# Altium project Banker.PrjPCB (part 3 of 5)

## Sheet FPGA.SchDoc: FPGA
size 420 x 297 mm; Author: G.K.; CompanyName: WUT; DrawnBy: G.K.; Organization: CERN; Address1: Warsaw Univeristy of Technology; Address2: Nowowiejska 15/19; DocumentNumber: 2; Revision: -; SheetNumber: 2; SheetTotal: 9; EDA_Number: ARTIQ; Projet: Banker; ModifiedBy: -; CreateDate: XX/XX/XXXX; CheckedDate: -; Title2: LVCMOS banks; DivGrp: ISE; Designer: G.K.; ModifiedDate: -; ProjectName: ADC/DAC MEZZANINE
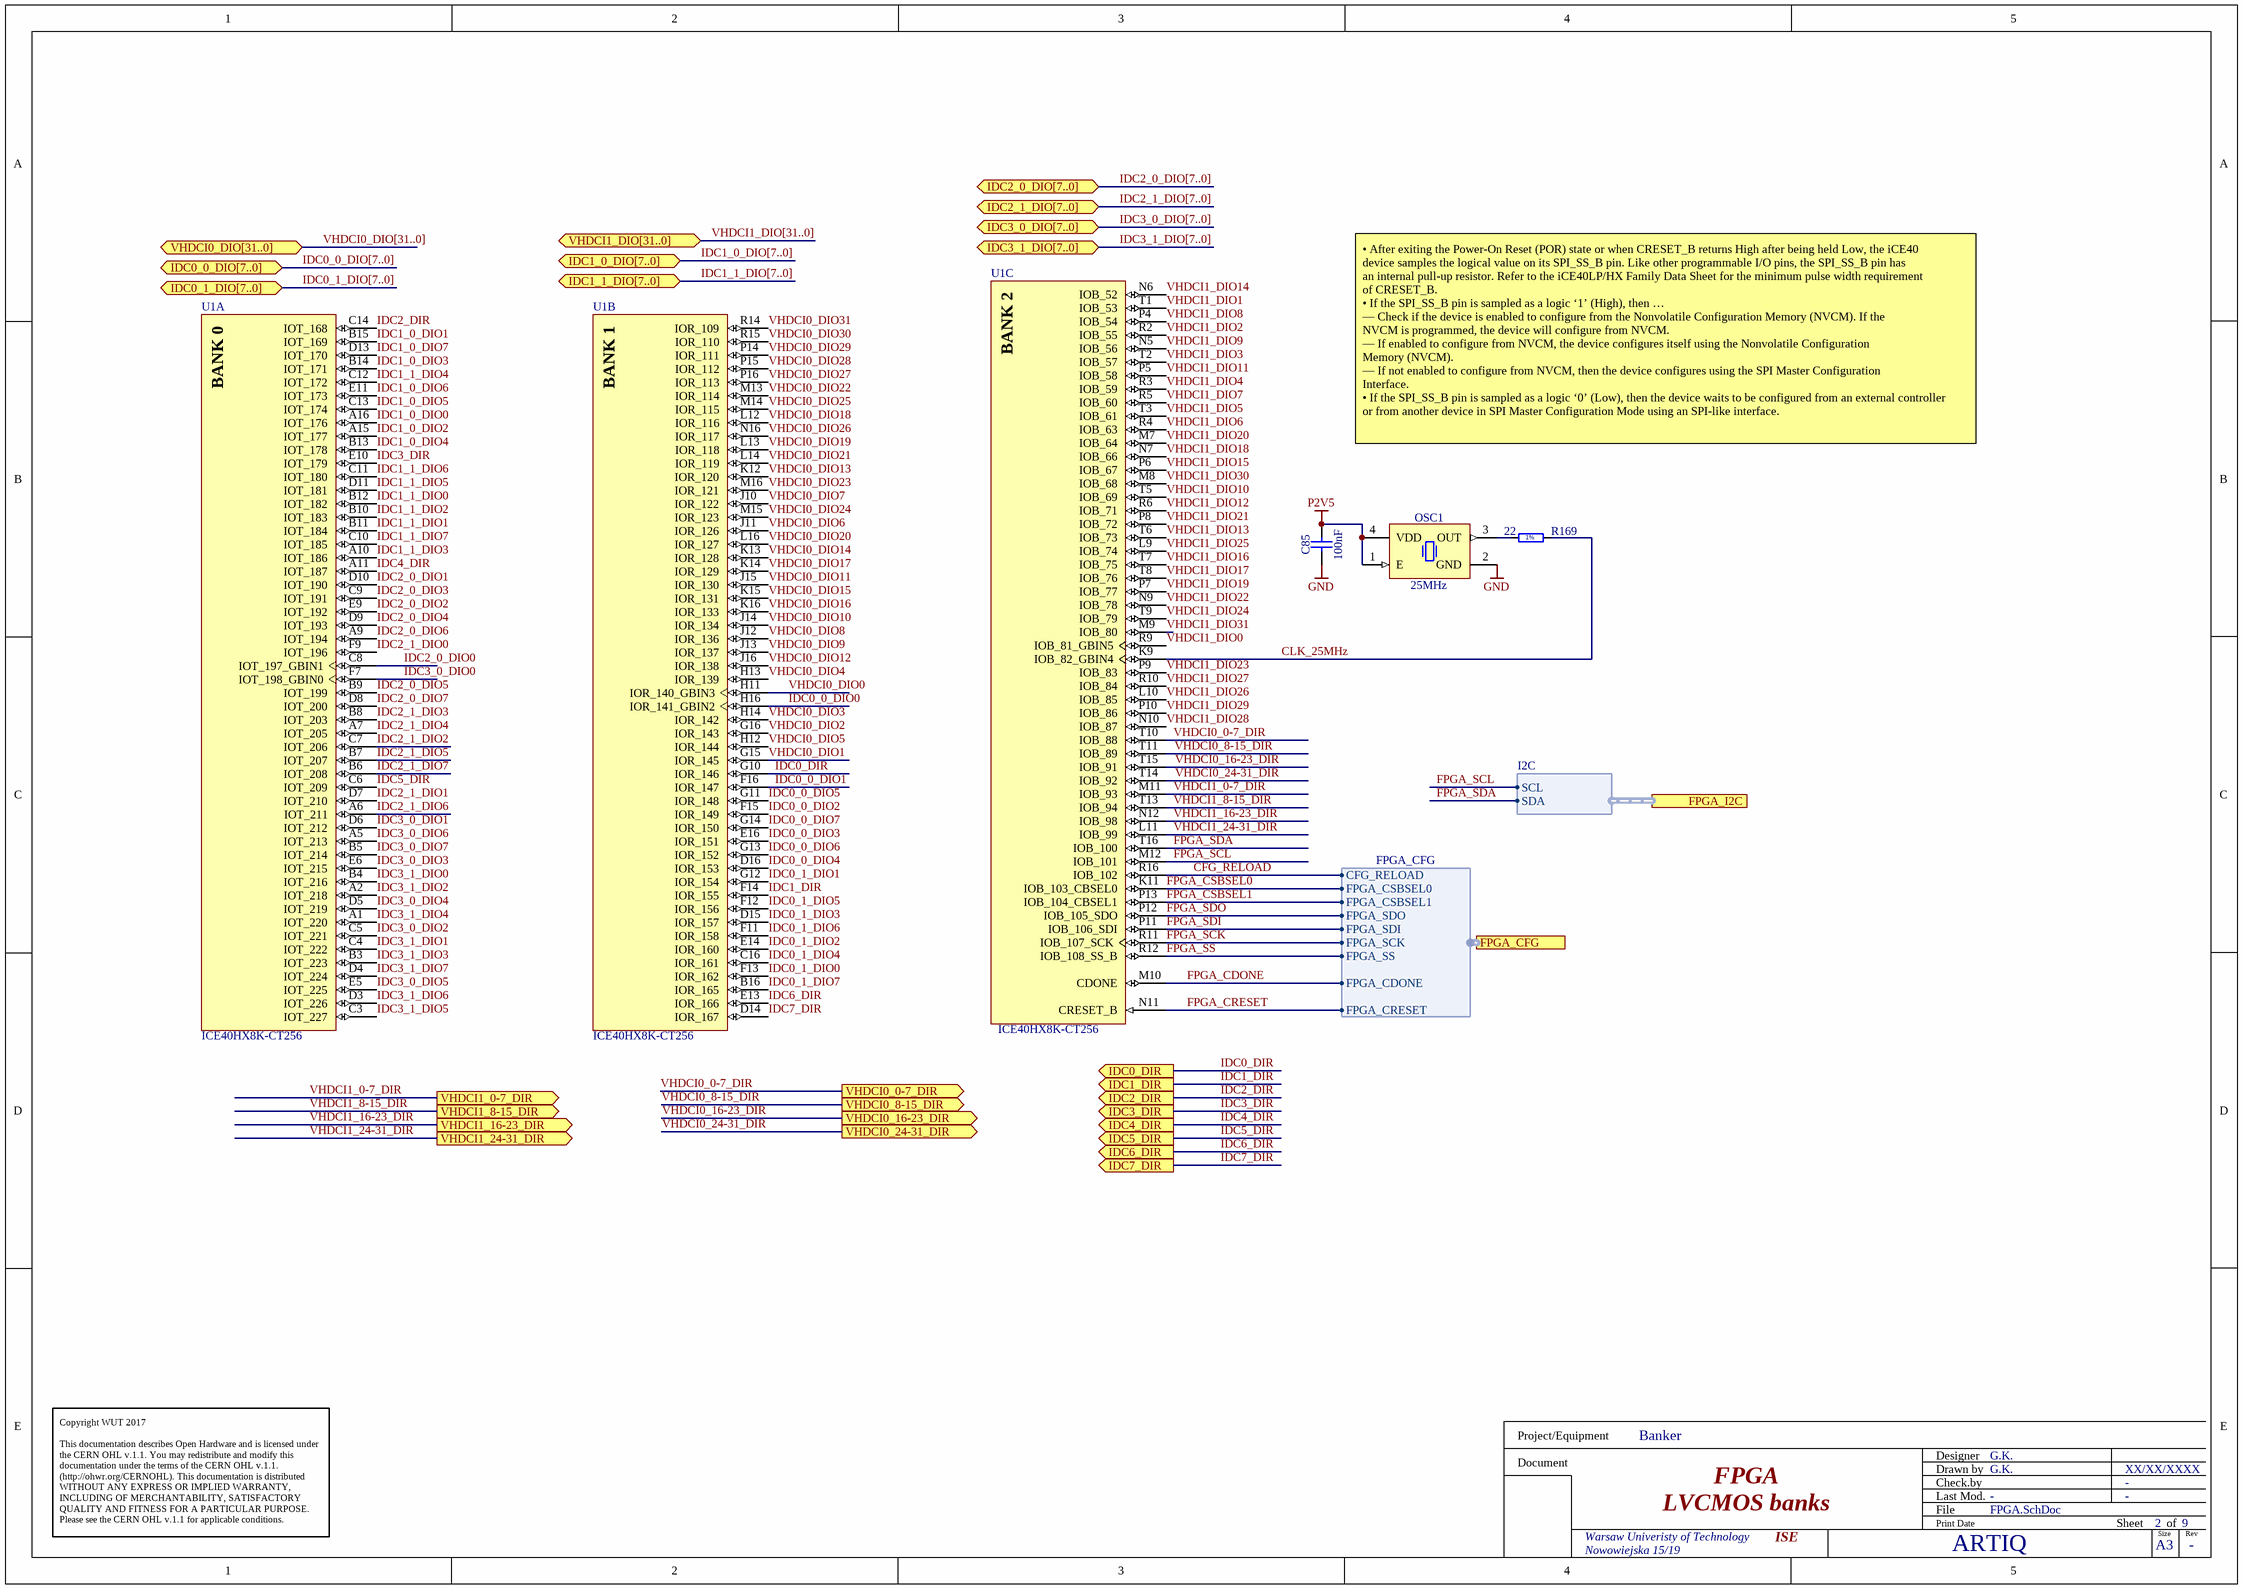
[diagram p5: FPGA.SchDoc]

### Parts
C85  100nF  [CAPC1005X55N]
OSC1  25MHz  [OSC_ECS_ECS-3525]
R169  22  [RESC1005X40N]
U1  ICE40HX8K-CT256  [LATC-caBGA-256]  (parts A,B,C of 5)

### Ports
FPGA_CFG (harness FPGA_CFG), FPGA_I2C (harness I2C), IDC0_0_DIO[7..0] (bidir), IDC0_1_DIO[7..0] (bidir), IDC0_DIR (out), IDC1_0_DIO[7..0] (bidir), IDC1_1_DIO[7..0] (bidir), IDC1_DIR (out), IDC2_0_DIO[7..0] (bidir), IDC2_1_DIO[7..0] (bidir), IDC2_DIR (out), IDC3_0_DIO[7..0] (bidir), IDC3_1_DIO[7..0] (bidir), IDC3_DIR (out), IDC4_DIR (out), IDC5_DIR (out), IDC6_DIR (out), IDC7_DIR (out), VHDCI0_0-7_DIR (out), VHDCI0_8-15_DIR (out), VHDCI0_16-23_DIR (out), VHDCI0_24-31_DIR (out), VHDCI0_DIO[31..0] (bidir), VHDCI1_0-7_DIR (out), VHDCI1_8-15_DIR (out), VHDCI1_16-23_DIR (out), VHDCI1_24-31_DIR (out), VHDCI1_DIO[31..0] (bidir)

### Harnesses
I2C: SDA, SCL
FPGA_CFG: FPGA_CSBSEL0, FPGA_CSBSEL1, FPGA_SDO, FPGA_SDI, FPGA_SCK, FPGA_SS, FPGA_CDONE, FPGA_CRESET, CFG_RELOAD

### Nets
GND: C85.1 OSC1.2(GND)
P2V5: C85.2 OSC1.1(E) OSC1.4(VDD)
CFG_RELOAD: U1.R16(IOB_102) ; port FPGA_CFG.CFG_RELOAD
CLK_25MHz: R169.2 U1.K9(IOB_82_GBIN4)
FPGA_CDONE: U1.M10(CDONE) ; port FPGA_CFG.FPGA_CDONE  [project net CDONE]
FPGA_CRESET: U1.N11(CRESET_B) ; port FPGA_CFG.FPGA_CRESET  [project net CRESET]
FPGA_CSBSEL0: U1.K11(IOB_103_CBSEL0) ; port FPGA_CFG.FPGA_CSBSEL0  [project net CSBSEL0]
FPGA_CSBSEL1: U1.P13(IOB_104_CBSEL1) ; port FPGA_CFG.FPGA_CSBSEL1  [project net CSBSEL1]
FPGA_SCK: U1.R11(IOB_107_SCK) ; port FPGA_CFG.FPGA_SCK  [project net FLASH_SCK]
FPGA_SCL: U1.M12(IOB_101) ; port FPGA_I2C.SCL
FPGA_SDA: U1.T16(IOB_100) ; port FPGA_I2C.SDA
FPGA_SDI: U1.P11(IOB_106_SDI) ; port FPGA_CFG.FPGA_SDI  [project net FLASH_SDO]
FPGA_SDO: U1.P12(IOB_105_SDO) ; port FPGA_CFG.FPGA_SDO  [project net FLASH_SDI]
FPGA_SS: U1.R12(IOB_108_SS_B) ; port FPGA_CFG.FPGA_SS  [project net FLASH_SS]
IDC0_0_DIO0: U1.H16(IOR_141_GBIN2)
IDC0_0_DIO1: U1.F16(IOR_147)
IDC0_0_DIO2: U1.F15(IOR_149)
IDC0_0_DIO3: U1.E16(IOR_151)
IDC0_0_DIO4: U1.D16(IOR_153)
IDC0_0_DIO5: U1.G11(IOR_148)
IDC0_0_DIO6: U1.G13(IOR_152)
IDC0_0_DIO7: U1.G14(IOR_150)
IDC0_1_DIO0: U1.F13(IOR_162)
IDC0_1_DIO1: U1.G12(IOR_154)
IDC0_1_DIO2: U1.E14(IOR_160)
IDC0_1_DIO3: U1.D15(IOR_157)
IDC0_1_DIO4: U1.C16(IOR_161)
IDC0_1_DIO5: U1.F12(IOR_156)
IDC0_1_DIO6: U1.F11(IOR_158)
IDC0_1_DIO7: U1.B16(IOR_165)
IDC0_DIR: U1.G10(IOR_146) ; port IDC0_DIR
IDC1_0_DIO0: U1.A16(IOT_176)  [project net IDC0_DIO0]
IDC1_0_DIO1: U1.B15(IOT_169)  [project net IDC0_DIO1]
IDC1_0_DIO2: U1.A15(IOT_177)  [project net IDC0_DIO2]
IDC1_0_DIO3: U1.B14(IOT_171)  [project net IDC0_DIO3]
IDC1_0_DIO4: U1.B13(IOT_178)  [project net IDC0_DIO4]
IDC1_0_DIO5: U1.C13(IOT_174)  [project net IDC0_DIO5]
IDC1_0_DIO6: U1.E11(IOT_173)  [project net IDC0_DIO6]
IDC1_0_DIO7: U1.D13(IOT_170)  [project net IDC0_DIO7]
IDC1_1_DIO0: U1.B12(IOT_182)
IDC1_1_DIO1: U1.B11(IOT_184)
IDC1_1_DIO2: U1.B10(IOT_183)
IDC1_1_DIO3: U1.A10(IOT_186)
IDC1_1_DIO4: U1.C12(IOT_172)
IDC1_1_DIO5: U1.D11(IOT_181)
IDC1_1_DIO6: U1.C11(IOT_180)
IDC1_1_DIO7: U1.C10(IOT_185)
IDC1_DIR: U1.F14(IOR_155) ; port IDC1_DIR
IDC2_0_DIO0: U1.C8(IOT_197_GBIN1)  [project net IDC0_DIO0]
IDC2_0_DIO1: U1.D10(IOT_190)  [project net IDC0_DIO1]
IDC2_0_DIO2: U1.E9(IOT_192)  [project net IDC0_DIO2]
IDC2_0_DIO3: U1.C9(IOT_191)  [project net IDC0_DIO3]
IDC2_0_DIO4: U1.D9(IOT_193)  [project net IDC0_DIO4]
IDC2_0_DIO5: U1.B9(IOT_199)  [project net IDC0_DIO5]
IDC2_0_DIO6: U1.A9(IOT_194)  [project net IDC0_DIO6]
IDC2_0_DIO7: U1.D8(IOT_200)  [project net IDC0_DIO7]
IDC2_1_DIO0: U1.F9(IOT_196)  [project net IDC1_DIO0]
IDC2_1_DIO1: U1.D7(IOT_210)  [project net IDC1_DIO1]
IDC2_1_DIO2: U1.C7(IOT_206)  [project net IDC1_DIO2]
IDC2_1_DIO3: U1.B8(IOT_203)  [project net IDC1_DIO3]
IDC2_1_DIO4: U1.A7(IOT_205)  [project net IDC1_DIO4]
IDC2_1_DIO5: U1.B7(IOT_207)  [project net IDC1_DIO5]
IDC2_1_DIO6: U1.A6(IOT_211)  [project net IDC1_DIO6]
IDC2_1_DIO7: U1.B6(IOT_208)  [project net IDC1_DIO7]
IDC2_DIR: U1.C14(IOT_168) ; port IDC2_DIR
IDC3_0_DIO0: U1.F7(IOT_198_GBIN0)  [project net IDC0_DIO0]
IDC3_0_DIO1: U1.D6(IOT_212)  [project net IDC0_DIO1]
IDC3_0_DIO2: U1.C5(IOT_221)  [project net IDC0_DIO2]
IDC3_0_DIO3: U1.E6(IOT_215)  [project net IDC0_DIO3]
IDC3_0_DIO4: U1.D5(IOT_219)  [project net IDC0_DIO4]
IDC3_0_DIO5: U1.E5(IOT_225)  [project net IDC0_DIO5]
IDC3_0_DIO6: U1.A5(IOT_213)  [project net IDC0_DIO6]
IDC3_0_DIO7: U1.B5(IOT_214)  [project net IDC0_DIO7]
IDC3_1_DIO0: U1.B4(IOT_216)  [project net IDC1_DIO0]
IDC3_1_DIO1: U1.C4(IOT_222)  [project net IDC1_DIO1]
IDC3_1_DIO2: U1.A2(IOT_218)  [project net IDC1_DIO2]
IDC3_1_DIO3: U1.B3(IOT_223)  [project net IDC1_DIO3]
IDC3_1_DIO4: U1.A1(IOT_220)  [project net IDC1_DIO4]
IDC3_1_DIO5: U1.C3(IOT_227)  [project net IDC1_DIO5]
IDC3_1_DIO6: U1.D3(IOT_226)  [project net IDC1_DIO6]
IDC3_1_DIO7: U1.D4(IOT_224)  [project net IDC1_DIO7]
IDC3_DIR: U1.E10(IOT_179) ; port IDC3_DIR
IDC4_DIR: U1.A11(IOT_187) ; port IDC4_DIR
IDC5_DIR: U1.C6(IOT_209) ; port IDC5_DIR
IDC6_DIR: U1.E13(IOR_166) ; port IDC6_DIR
IDC7_DIR: U1.D14(IOR_167) ; port IDC7_DIR
VHDCI0_0-7_DIR: U1.T10(IOB_88) ; port VHDCI0_0-7_DIR
VHDCI0_8-15_DIR: U1.T11(IOB_89) ; port VHDCI0_8-15_DIR
VHDCI0_16-23_DIR: U1.T15(IOB_91) ; port VHDCI0_16-23_DIR
VHDCI0_24-31_DIR: U1.T14(IOB_92) ; port VHDCI0_24-31_DIR
VHDCI0_DIO0: U1.H11(IOR_140_GBIN3)
VHDCI0_DIO1: U1.G15(IOR_145)
VHDCI0_DIO2: U1.G16(IOR_143)
VHDCI0_DIO3: U1.H14(IOR_142)
VHDCI0_DIO4: U1.H13(IOR_139)
VHDCI0_DIO5: U1.H12(IOR_144)
VHDCI0_DIO6: U1.J11(IOR_126)
VHDCI0_DIO7: U1.J10(IOR_122)
VHDCI0_DIO8: U1.J12(IOR_136)
VHDCI0_DIO9: U1.J13(IOR_137)
VHDCI0_DIO10: U1.J14(IOR_134)
VHDCI0_DIO11: U1.J15(IOR_130)
VHDCI0_DIO12: U1.J16(IOR_138)
VHDCI0_DIO13: U1.K12(IOR_120)
VHDCI0_DIO14: U1.K13(IOR_128)
VHDCI0_DIO15: U1.K15(IOR_131)
VHDCI0_DIO16: U1.K16(IOR_133)
VHDCI0_DIO17: U1.K14(IOR_129)
VHDCI0_DIO18: U1.L12(IOR_116)
VHDCI0_DIO19: U1.L13(IOR_118)
VHDCI0_DIO20: U1.L16(IOR_127)
VHDCI0_DIO21: U1.L14(IOR_119)
VHDCI0_DIO22: U1.M13(IOR_114)
VHDCI0_DIO23: U1.M16(IOR_121)
VHDCI0_DIO24: U1.M15(IOR_123)
VHDCI0_DIO25: U1.M14(IOR_115)
VHDCI0_DIO26: U1.N16(IOR_117)
VHDCI0_DIO27: U1.P16(IOR_113)
VHDCI0_DIO28: U1.P15(IOR_112)
VHDCI0_DIO29: U1.P14(IOR_111)
VHDCI0_DIO30: U1.R15(IOR_110)
VHDCI0_DIO31: U1.R14(IOR_109)
VHDCI1_0-7_DIR: U1.M11(IOB_93) ; port VHDCI1_0-7_DIR
VHDCI1_8-15_DIR: U1.T13(IOB_94) ; port VHDCI1_8-15_DIR
VHDCI1_16-23_DIR: U1.N12(IOB_98) ; port VHDCI1_16-23_DIR
VHDCI1_24-31_DIR: U1.L11(IOB_99) ; port VHDCI1_24-31_DIR
VHDCI1_DIO0: U1.R9(IOB_81_GBIN5)
VHDCI1_DIO1: U1.T1(IOB_53)
VHDCI1_DIO2: U1.R2(IOB_55)
VHDCI1_DIO3: U1.T2(IOB_57)
VHDCI1_DIO4: U1.R3(IOB_59)
VHDCI1_DIO5: U1.T3(IOB_61)
VHDCI1_DIO6: U1.R4(IOB_63)
VHDCI1_DIO7: U1.R5(IOB_60)
VHDCI1_DIO8: U1.P4(IOB_54)
VHDCI1_DIO9: U1.N5(IOB_56)
VHDCI1_DIO10: U1.T5(IOB_69)
VHDCI1_DIO11: U1.P5(IOB_58)
VHDCI1_DIO12: U1.R6(IOB_71)
VHDCI1_DIO13: U1.T6(IOB_73)
VHDCI1_DIO14: U1.N6(IOB_52)
VHDCI1_DIO15: U1.P6(IOB_67)
VHDCI1_DIO16: U1.T7(IOB_75)
VHDCI1_DIO17: U1.T8(IOB_76)
VHDCI1_DIO18: U1.N7(IOB_66)
VHDCI1_DIO19: U1.P7(IOB_77)
VHDCI1_DIO20: U1.M7(IOB_64)
VHDCI1_DIO21: U1.P8(IOB_72)
VHDCI1_DIO22: U1.N9(IOB_78)
VHDCI1_DIO23: U1.P9(IOB_83)
VHDCI1_DIO24: U1.T9(IOB_79)
VHDCI1_DIO25: U1.L9(IOB_74)
VHDCI1_DIO26: U1.L10(IOB_85)
VHDCI1_DIO27: U1.R10(IOB_84)
VHDCI1_DIO28: U1.N10(IOB_87)
VHDCI1_DIO29: U1.P10(IOB_86)
VHDCI1_DIO30: U1.M8(IOB_68)
VHDCI1_DIO31: U1.M9(IOB_80)
NetOSC1_3: OSC1.3(OUT) R169.1

### Buses and harness runs
bus IDC0_0_DIO[7..0] = port IDC0_0_DIO[7..0]
bus IDC0_1_DIO[7..0] = port IDC0_1_DIO[7..0]
bus IDC1_0_DIO[7..0] = port IDC1_0_DIO[7..0]
bus IDC1_1_DIO[7..0] = port IDC1_1_DIO[7..0]
bus IDC2_0_DIO[7..0] = port IDC2_0_DIO[7..0]
bus IDC2_1_DIO[7..0] = port IDC2_1_DIO[7..0]
bus IDC3_0_DIO[7..0] = port IDC3_0_DIO[7..0]
bus IDC3_1_DIO[7..0] = port IDC3_1_DIO[7..0]
bus VHDCI0_DIO[31..0] = port VHDCI0_DIO[31..0]
bus VHDCI1_DIO[31..0] = port VHDCI1_DIO[31..0]

### Notes on the sheet
- • After exiting the Power-On Reset (POR) state or when CRESET_B returns High after being held Low, the iCE40
  device samples the logical value on its SPI_SS_B pin. Like other programmable I/O pins, the SPI_SS_B pin has
  an internal pull-up resistor. Refer to the iCE40LP/HX Family Data Sheet for the minimum pulse width requirement
  of CRESET_B.
  • If the SPI_SS_B pin is sampled as a logic ‘1’ (High), then …
  — Check if the device is enabled to configure from the Nonvolatile Configuration Memory (NVCM). If the
  NVCM is programmed, the device will configure from NVCM.
  — If enabled to configure from NVCM, the device configures itself using the Nonvolatile Configuration
  Memory (NVCM).
  — If not enabled to configure from NVCM, then the device configures using the SPI Master Configuration
  Interface.
  • If the SPI_SS_B pin is sampled as a logic ‘0’ (Low), then the device waits to be configured from an external controller
  or from another device in SPI Master Configuration Mode using an SPI-like interface.
- Copyright WUT 2017
  This documentation describes Open Hardware and is licensed under the CERN OHL v.1.1. You may redistribute and modify this documentation under the terms of the CERN OHL v.1.1. (http://ohwr.org/CERNOHL). This documentation is distributed WITHOUT ANY EXPRESS OR IMPLIED WARRANTY, INCLUDING OF MERCHANTABILITY, SATISFACTORY QUALITY AND FITNESS FOR A PARTICULAR PURPOSE. Please see the CERN OHL v.1.1 for applicable conditions.
- Project/Equipment
- Document
- Designer
- Drawn by
- Check.by
- File
- Last Mod.
- Print Date
- Sheet
- Size
- A3
- of
- Rev
- (in symbol CMP-0962-00001-1, part A) BANK 0
- (in symbol CMP-0962-00001-1, part B) BANK 1
- (in symbol CMP-0962-00001-1, part C) BANK 2
- (in symbol R0402_22R_1%_0.0625W_100PPM) 1%

### Library data of the parts
C85 = CC0402_100NF_16V_10%_X5R: Non-polarised capacitor; Part Description: SMD Multilayer Chip Ceramic Capacitor; Manufacturer: GENERIC; Manufacturer1 Part Number: GRM155R61C104KA88D; Voltage: 16V; TC: X5R; Tolerance: ±10%; Part Number: CC0402_100NF_16V_10%_X5R; Component Kind: Standard; Component Type: Standard; Pin Count: 2; Value: 100nF; Status: None; Manufacturer Part Number: CC0402_100NF_16V_10%_X5R; Case: 0402; Mounted: Yes; Socket: No; SMD: Yes; Sense: No; Manufacturer1 Example: MURATA; Manufacturer1 ComponentHeight: 0.55mm; HelpURL: \\cern.ch\dfs\Applications\Altium\Datasheets\CC0402_X5R_MURATA_GRM.pdf; Author: CERN DEM JLC; CreateDate: 10.12.2013; LatestRevisionDate: 10.12.2013
OSC1 = OSC_25MHZ_ECS_ECS-3525-250-B: Oscillator 4 pins 1=E/D 2=GND 3=OUT 4=VDD; Part Description: 2.5V, ±50ppm, 15pF, -0 to 70°C, Surface Mount Clock Oscillator (ECS-3518/3525 Series); Manufacturer: ECS; PressFit: No; Bonding: No; Part Number: OSC_25MHZ_ECS_ECS-3525-250-B; Component Kind: Standard; Component Type: Standard; PackageDescription: SMD Oscillator, 4 pins, 5 x 3.2mm, ECS-3525 Series; Value: 25MHz; Manufacturer Part Number: ECS-3525-250-B; Pin Count: 4; Mounted: Yes; Socket: No; SMD: Yes; Sense: No; ComponentHeight: 1.3mm; HelpURL: \\cern.ch\dfs\Applications\Altium\Datasheets\OSC_ECS_ECS-3525.pdf; Author: CERN DEM JLC; CreateDate: 14/08/2017; LatestRevisionDate: 14/08/2017
R169 = R0402_22R_1%_0.0625W_100PPM: Resistor - 1%; Part Description: General Purpose Thick Film Chip Resistor; Manufacturer: GENERIC; Manufacturer1 Part Number: 232270672209L; TC: ±100ppm/°C; PressFit: No; Part Number: R0402_22R_1%_0.0625W_100PPM; Component Kind: Standard; Component Type: Standard; Pin Count: 2; Value: 22; Status: Not Recommended; Power: 0.0625W; Tolerance: ±1%; Manufacturer Part Number: R0402_22R_1%_0.0625W_100PPM; Case: 0402; Mounted: Yes; Sense: No; Socket: No; SMD: Yes; Manufacturer1 Example: YAGEO PHYCOMP; Manufacturer1 ComponentHeight: 0.4mm; HelpURL: \\cern.ch\dfs\Applications\Altium\Datasheets\R0402_Phycomp_RC0402.pdf; Author: CERN DEM JLC; CreateDate: 03/12/2007; LatestRevisionDate: 17/10/2012
U1 = CMP-0962-00001-1: iCE40 HX8K Series FPGA Family, 7680 Logic Cells, 1.2 V Core, 128 K Embedded RAM Bits, 256-ball caBGA, Pb-Free, Tray; Manufacturer: Lattice Semiconductor; Supply Voltage: 1.2V; Phase-Locked Loops: 2; Logic Cells: 7680; Embedded RAM Bits: 128K; PackageReference: caBGA-256; PackageDescription: 256-Ball Chip Array Ball Grid Array, Body 14 x 14 mm, Pitch 0.8 mm; RoHS: TRUE; Packing: Tray; Mounting Technology: Surface Mount; ComponentLink3URL: http://www.latticesemi.com/lit/docs/package/pkg.pdf; ComponentLink1Description: Manufacturer URL; ComponentLink3Description: Package Specification; Code_JEDEC: MO-275; PackageVersion: Rev. 03.9, 02/2013; ComponentLink1URL: http://www.latticesemi.com/en; ComponentLink2URL: http://www.latticesemi.com/~/media/Documents/DataSheets/iCE/iCE40LPHXFamilyDataSheet.pdf; PartNumber: ICE40HX8K-CT256; ComponentLink2Description: Datasheet; DatasheetVersion: Rev. 02.9

## Sheet I2C_switch.SchDoc: I2C
size 420 x 297 mm; Author: G.K.; CompanyName: WUT; DrawnBy: G.K.; Organization: CERN; Address1: Warsaw Univeristy of Technology; Address2: Nowowiejska 15/19; DocumentNumber: 8; Revision: -; SheetNumber: 8; SheetTotal: 9; EDA_Number: ARTIQ; Projet: Banker; ModifiedBy: -; CreateDate: XX/XX/XXXX; CheckedDate: -; Title2: Switch; DivGrp: ISE; Designer: G.K.; ModifiedDate: -; ProjectName: ADC/DAC MEZZANINE
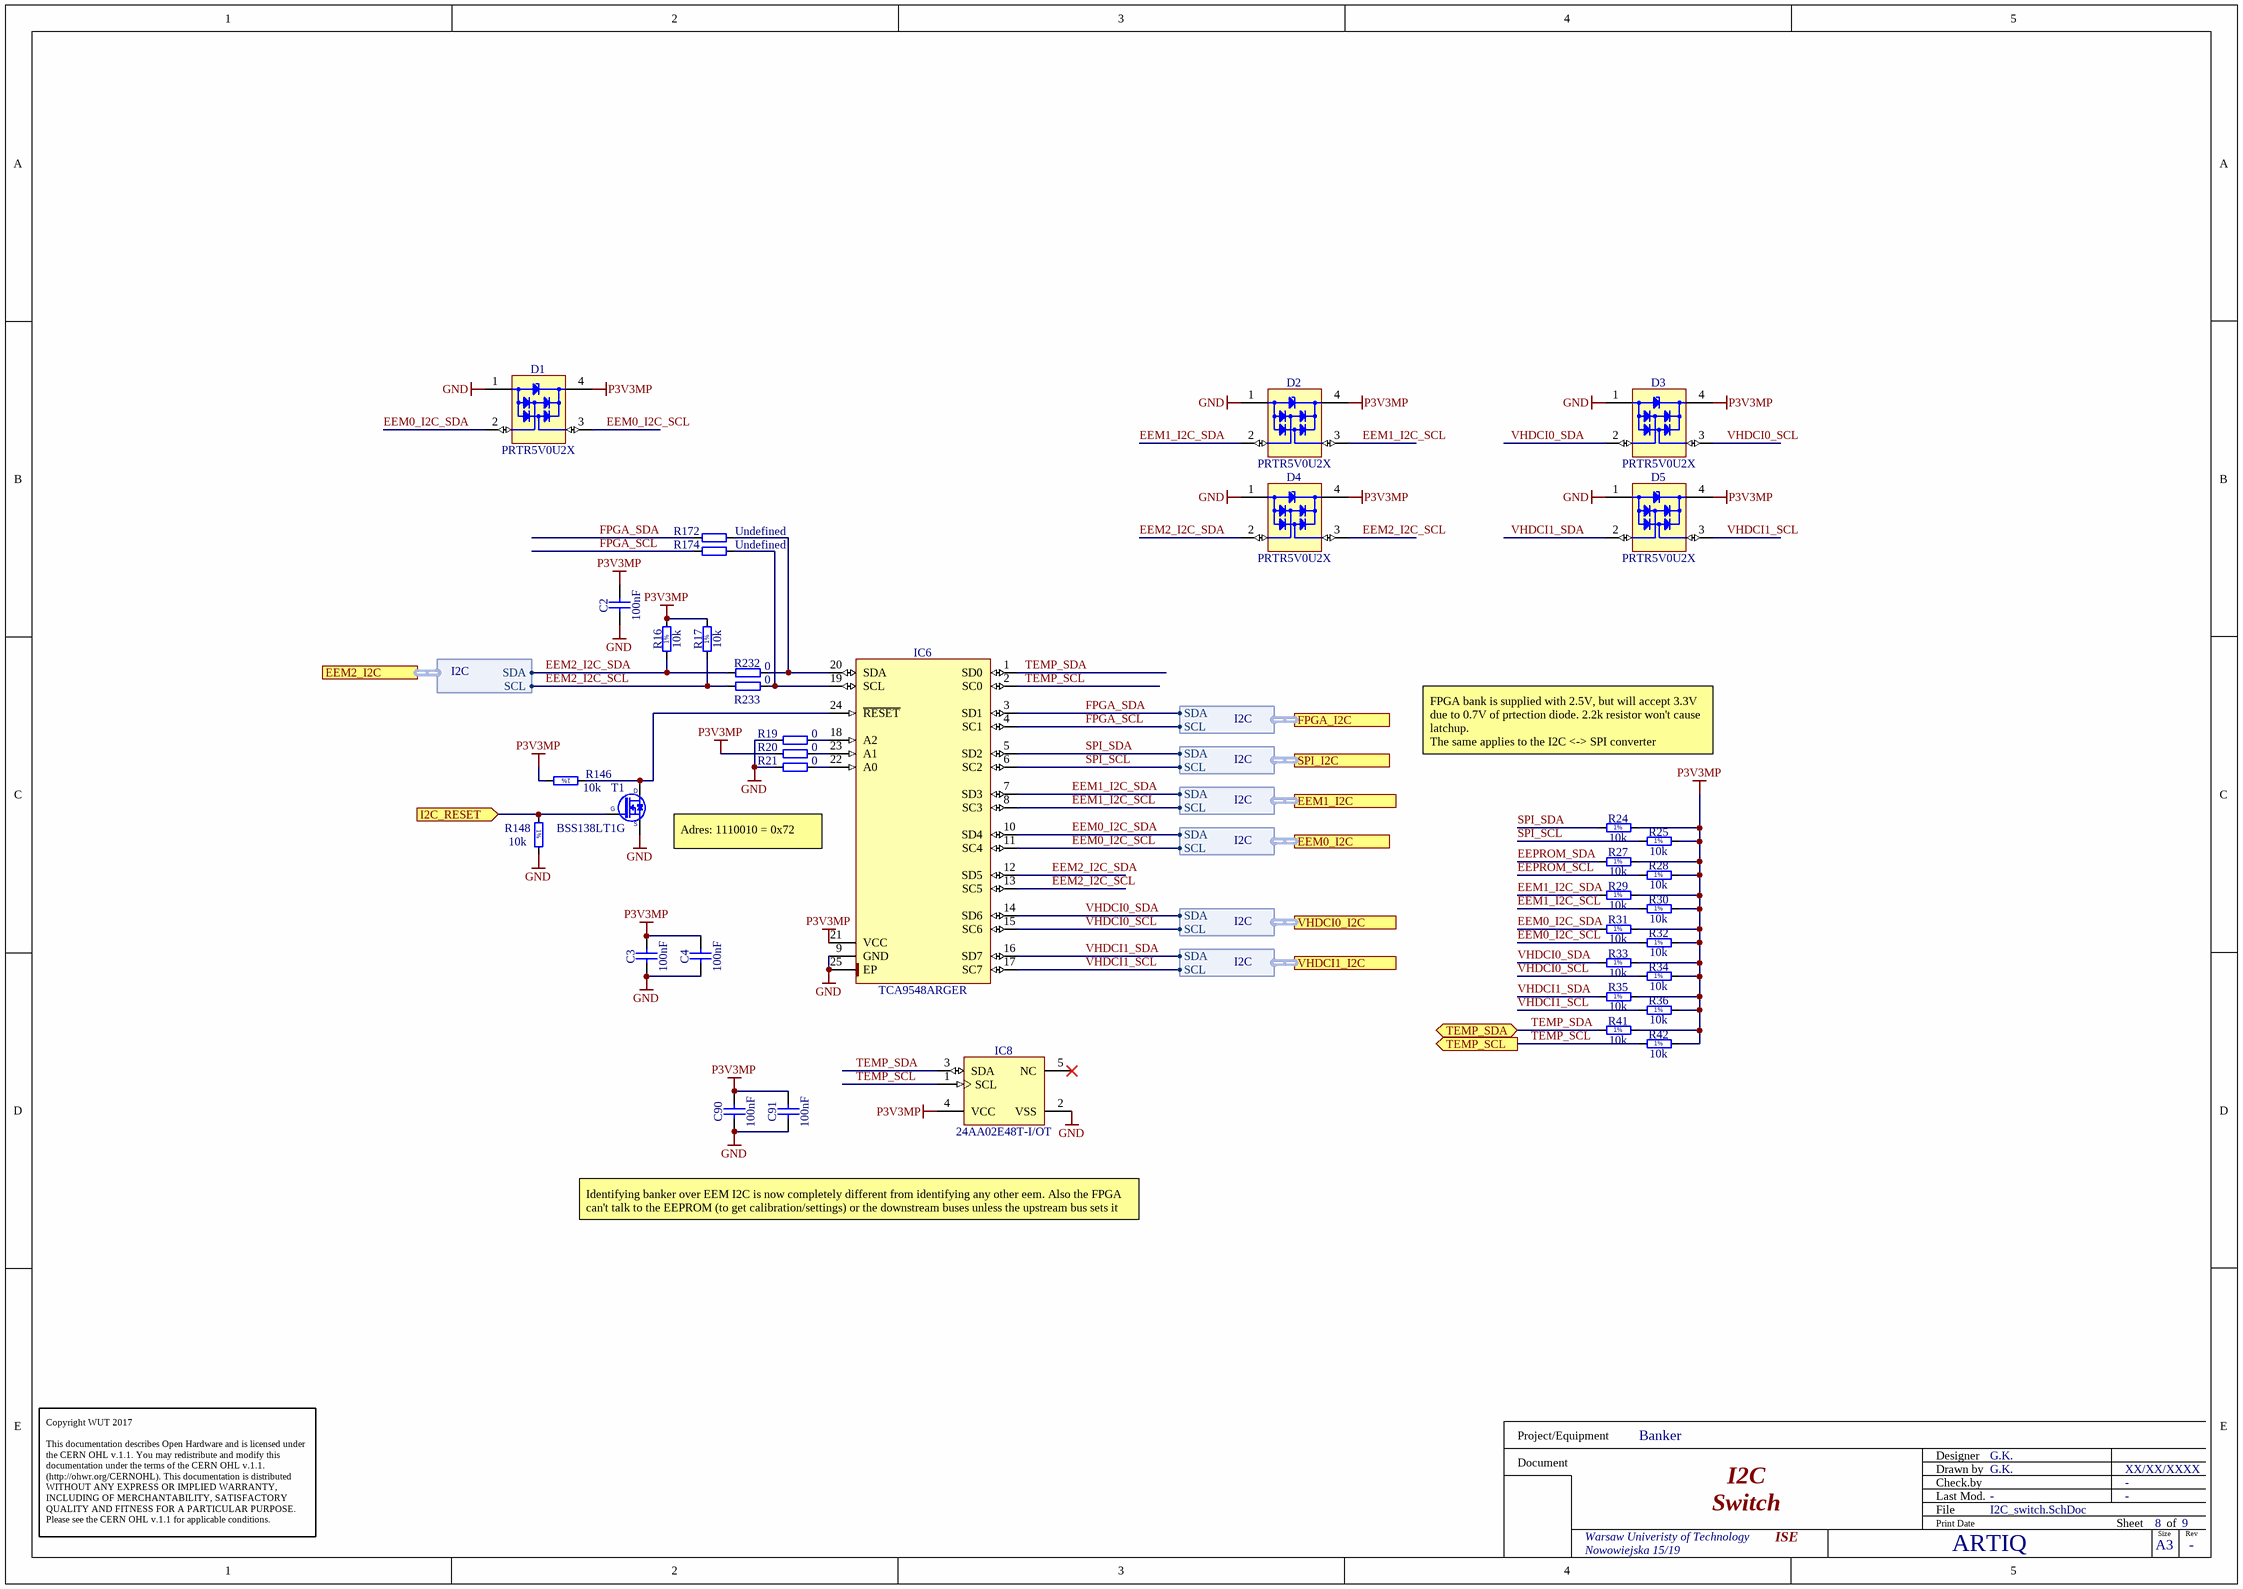
[diagram p6: I2C_switch.SchDoc]

### Parts
C2  100nF  [CAPC1005X55N]
C3  100nF  [CAPC1005X55N]
C4  100nF  [CAPC1005X55N]
C90  100nF  [CAPC1005X55N]
C91  100nF  [CAPC1005X55N]
D1  PRTR5V0U2X  [SOT190P230X110-4N]
D2  PRTR5V0U2X  [SOT190P230X110-4N]
D3  PRTR5V0U2X  [SOT190P230X110-4N]
D4  PRTR5V0U2X  [SOT190P230X110-4N]
D5  PRTR5V0U2X  [SOT190P230X110-4N]
IC6  TCA9548ARGER  [QFN50P400X400X100-25N-S220]
IC8  24AA02E48T-I/OT  [SOT95P280X145-5N]
R16  10k  [RESC1005X40N]
R17  10k  [RESC1005X40N]
R19  0  [RESC1005X40N]
R20  0  [RESC1005X40N]
R21  0  [RESC1005X40N]
R24  10k  [RESC1005X40N]
R25  10k  [RESC1005X40N]
R27  10k  [RESC1005X40N]
R28  10k  [RESC1005X40N]
R29  10k  [RESC1005X40N]
R30  10k  [RESC1005X40N]
R31  10k  [RESC1005X40N]
R32  10k  [RESC1005X40N]
R33  10k  [RESC1005X40N]
R34  10k  [RESC1005X40N]
R35  10k  [RESC1005X40N]
R36  10k  [RESC1005X40N]
R41  10k  [RESC1005X40N]
R42  10k  [RESC1005X40N]
R146  10k  [RESC1005X40N]
R148  10k  [RESC1005X40N]
R172  Undefined  [RESC1608X55N]
R174  Undefined  [RESC1608X55N]
R232  0  [RESC1608X55N]
R233  0  [RESC1608X55N]
T1  BSS138LT1G  [SOT95P240X110-3N]

### Ports
EEM0_I2C (harness I2C), EEM1_I2C (harness I2C), EEM2_I2C (harness I2C), FPGA_I2C (harness I2C), I2C_RESET (in), SPI_I2C (harness I2C), TEMP_SCL (out), TEMP_SDA (bidir), VHDCI0_I2C (harness I2C), VHDCI1_I2C (harness I2C)

### Harnesses
I2C: SDA, SCL

### Nets
GND: C2.1 C3.1 C4.1 C90.1 C91.1 D1.1(GND) D2.1(GND) D3.1(GND) D4.1(GND) D5.1(GND) IC6.9(GND) IC6.25(EP) IC8.2(VSS) R19.1 R21.1 R148.2 T1.2(S)
P3V3MP: C2.2 C3.2 C4.2 C90.2 C91.2 D1.4(VCC) D2.4(VCC) D3.4(VCC) D4.4(VCC) D5.4(VCC) IC6.21(VCC) IC8.4(VCC) R16.2 R17.2 R20.1 R24.2 R25.2 R27.2 R28.2 R29.2 R30.2 R31.2 R32.2 R33.2 R34.2 R35.2 R36.2 R41.2 R42.2 R146.2
EEM0_I2C_SCL: D1.3(I/O2) IC6.11(SC4) R32.1 ; port EEM0_I2C.SCL
EEM0_I2C_SDA: D1.2(I/O1) IC6.10(SD4) R31.1 ; port EEM0_I2C.SDA
EEM1_I2C_SCL: D2.3(I/O2) IC6.8(SC3) R30.1 ; port EEM1_I2C.SCL
EEM1_I2C_SDA: D2.2(I/O1) IC6.7(SD3) R29.1 ; port EEM1_I2C.SDA
EEM2_I2C_SCL: D4.3(I/O2) IC6.13(SC5) R17.1 R233.1 ; port EEM2_I2C.SCL
EEM2_I2C_SDA: D4.2(I/O1) IC6.12(SD5) R16.1 R232.1 ; port EEM2_I2C.SDA
EEPROM_SCL: R28.1
EEPROM_SDA: R27.1
FPGA_SCL: IC6.4(SC1) R174.1 ; port FPGA_I2C.SCL
FPGA_SDA: IC6.3(SD1) R172.1 ; port FPGA_I2C.SDA
SPI_SCL: IC6.6(SC2) R25.1 ; port SPI_I2C.SCL
SPI_SDA: IC6.5(SD2) R24.1 ; port SPI_I2C.SDA
TEMP_SCL: IC6.2(SC0) IC8.1(SCL) R42.1 ; port TEMP_SCL
TEMP_SDA: IC6.1(SD0) IC8.3(SDA) R41.1 ; port TEMP_SDA
VHDCI0_SCL: D3.3(I/O2) IC6.15(SC6) R34.1 ; port VHDCI0_I2C.SCL
VHDCI0_SDA: D3.2(I/O1) IC6.14(SD6) R33.1 ; port VHDCI0_I2C.SDA
VHDCI1_SCL: D5.3(I/O2) IC6.17(SC7) R36.1 ; port VHDCI1_I2C.SCL
VHDCI1_SDA: D5.2(I/O1) IC6.16(SD7) R35.1 ; port VHDCI1_I2C.SDA
NetIC6_18: IC6.18(A2) R19.2
NetIC6_19: IC6.19(SCL) R174.2 R233.2
NetIC6_20: IC6.20(SDA) R172.2 R232.2
NetIC6_22: IC6.22(A0) R21.2
NetIC6_23: IC6.23(A1) R20.2
NetIC6_24: IC6.24(~{RESET}) R146.1 T1.3(D)
NetR148_1: R148.1 T1.1(G) ; port I2C_RESET

Not connected (* = marked no-connect by the designer): IC8 5(NC)*

### Notes on the sheet
- FPGA bank is supplied with 2.5V, but will accept 3.3V due to 0.7V of prtection diode. 2.2k resistor won't cause latchup.
  The same applies to the I2C <-> SPI converter
- Adres: 1110010 = 0x72
- Identifying banker over EEM I2C is now completely different from identifying any other eem. Also the FPGA can't talk to the EEPROM (to get calibration/settings) or the downstream buses unless the upstream bus sets it up.
- Copyright WUT 2017
  This documentation describes Open Hardware and is licensed under the CERN OHL v.1.1. You may redistribute and modify this documentation under the terms of the CERN OHL v.1.1. (http://ohwr.org/CERNOHL). This documentation is distributed WITHOUT ANY EXPRESS OR IMPLIED WARRANTY, INCLUDING OF MERCHANTABILITY, SATISFACTORY QUALITY AND FITNESS FOR A PARTICULAR PURPOSE. Please see the CERN OHL v.1.1 for applicable conditions.
- Project/Equipment
- Document
- Designer
- Drawn by
- Check.by
- File
- Last Mod.
- Print Date
- Sheet
- Size
- A3
- of
- Rev
- (in symbol R0402_10k_1%_0.0625W_100PPM) 1%
- (in symbol R0402_10K_1%_0.0625W_100PPM) 1%

### Library data of the parts
C2-C4 C90 C91 = CC0402_100NF_16V_10%_X5R: as C85 on sheet FPGA; Part Number: CC0402_100NF_16V_10%_X5R; Component Kind: Standard; Component Type: Standard; Pin Count: 2; Value: 100nF; Status: None; Manufacturer Part Number: CC0402_100NF_16V_10%_X5R; Case: 0402; Mounted: Yes; Socket: No; SMD: Yes; Sense: No; Manufacturer1 Example: MURATA; Manufacturer1 ComponentHeight: 0.55mm; HelpURL: \\cern.ch\dfs\Applications\Altium\Datasheets\CC0402_X5R_MURATA_GRM.pdf; Author: CERN DEM JLC; CreateDate: 10/12/2013; LatestRevisionDate: 10/12/2013
D1-D5 = PRTR5V0U2X: Ultra Low Capacitance Double Rail-to-Rail ESD Protection Diode; Part Description: Ultra Low Capacitance (1pF) Double Rail-to-Rail ESD Protection Diode (8kV); Manufacturer: NXP SEMICONDUCTORS; Voltage: 5.5V; PressFit: No; Bonding: No; Part Number: PRTR5V0U2X; Component Kind: Standard; Component Type: Standard; Device: PRTR5V0U2X; PackageDescription: SOT143B, SOT, 1.90mm Pitch; 4 Pin, 1.30mm W X 2.90mm L X 1.10mm H body, IPC Medium Density; Manufacturer Part Number: PRTR5V0U2X; Pin Count: 4; Case: SOT143B; Mounted: Yes; Socket: No; SMD: Yes; Sense: No; ComponentHeight: 1.1mm; HelpURL: \\cern.ch\dfs\Applications\Altium\Datasheets\PRTR5V0U2X.pdf; Author: CERN DEM JLC; CreateDate: 22.03.2011; LatestRevisionDate: 22.03.2011
IC6 = TCA9548ARGER: Low Voltage 8-Channel I2C Switch With Reset; Manufacturer: TEXAS INSTRUMENTS; PressFit: No; Bonding: No; Part Number: TCA9548ARGER; Component Kind: Standard; Component Type: Standard; Device: TCA9548ARGER; PackageDescription: QFN, 0.50mm Pitch, Square; 24 Pin, 4.00mm L X 4.00mm W X 1.00mm H body (w/thermal tab 2.2 X 2.2mm), IPC Medium Density; Part Description: Low Voltage 8-Channel I2C Switch With Reset; Manufacturer Part Number: TCA9548ARGER; Pin Count: 25; Case: QFN24; Mounted: Yes; Socket: No; SMD: Yes; Sense: No; ComponentHeight: 1mm; Author: CERN DEM JLC; HelpURL: \\cern.ch\dfs\Applications\Altium\Datasheets\TCA9548ARGER.pdf; CreateDate: 07.07.2014; LatestRevisionDate: 07.07.2014
IC8 = 24AA02E48T-I/OT: 1.7V-5.5V, 2K I2C Serial EEPROM With EUI-48 Node Identity; Manufacturer: MICROCHIP TECHNOLOGY; PressFit: No; Bonding: No; Part Number: 24AA02E48T-I/OT; Component Kind: Standard; Component Type: Standard; Device: 24AA02E48T-I/OT; PackageDescription: SOT, 0.95mm pitch; 5 pin, 1.60mm W X 2.90mm L X 1.45mm H body, IPC Medium Density; Part Description: 1.7V-5.5V, 2K I2C Serial EEPROM With EUI-48 Node Identity; Manufacturer Part Number: 24AA02E48T-I/OT; Pin Count: 5; Case: SOT23-5; Mounted: Yes; Socket: No; SMD: Yes; Sense: No; ComponentHeight: 1.45mm; HelpURL: \\cern.ch\dfs\Applications\Altium\Datasheets\24AA02E48T-I-OT.pdf; Author: CERN DEM MR; CreateDate: 2016-03-31; LatestRevisionDate: 2016-03-31
R16 R17 = R0402_10k_1%_0.0625W_100PPM: Resistor - 1%; Part Description: General Purpose Thick Film Chip Resistor; Manufacturer: GENERIC; Manufacturer1 Part Number: 232270671003L; TC: ±100ppm/°C; PressFit: No; Part Number: R0402_10K_1%_0.0625W_100PPM; Component Kind: Standard; Component Type: Standard; Pin Count: 2; Value: 10k; Status: Not Recommended; Power: 0.0625W; Tolerance: ±1%; Manufacturer Part Number: R0402_10K_1%_0.0625W_100PPM; Case: 0402; Mounted: Yes; Sense: No; Socket: No; SMD: Yes; Manufacturer1 Example: YAGEO PHYCOMP; Manufacturer1 ComponentHeight: 0.4mm; HelpURL: \\cern.ch\dfs\Applications\Altium\Datasheets\R0402_Phycomp_RC0402.pdf; Author: CERN DEM JLC; CreateDate: 03.12.2007; LatestRevisionDate: 17.10.2012
R19-R21 = R0402_0R_JUMPER: Resistor; Part Description: 1A (0.05R Max DC Resistance) Zero Ohm Jumper; Manufacturer: GENERIC; Manufacturer1 Part Number: 232270591001L; PressFit: No; Part Number: R0402_0R_JUMPER; Component Kind: Standard; Component Type: Standard; Pin Count: 2; Value: 0; Status: Not Recommended; Manufacturer Part Number: R0402_0R_JUMPER; Case: 0402; Mounted: Yes; Sense: No; Socket: No; SMD: Yes; Manufacturer1 Example: YAGEO PHYCOMP; Manufacturer1 ComponentHeight: 0.4mm; HelpURL: \\cern.ch\dfs\Applications\Altium\Datasheets\R0402_Phycomp_RC0402.pdf; Author: CERN DEM JLC; CreateDate: 03.12.2007; LatestRevisionDate: 17.10.2012
R24 R25 R27-R36 R41 R42 = R0402_10K_1%_0.0625W_100PPM: Resistor - 1%; Part Description: General Purpose Thick Film Chip Resistor; Manufacturer: GENERIC; Manufacturer1 Part Number: 232270671003L; TC: ±100ppm/°C; PressFit: No; Part Number: R0402_10K_1%_0.0625W_100PPM; Component Kind: Standard; Component Type: Standard; Pin Count: 2; Value: 10k; Status: Not Recommended; Power: 0.0625W; Tolerance: ±1%; Manufacturer Part Number: R0402_10K_1%_0.0625W_100PPM; Case: 0402; Mounted: Yes; Sense: No; Socket: No; SMD: Yes; Manufacturer1 Example: YAGEO PHYCOMP; Manufacturer1 ComponentHeight: 0.4mm; HelpURL: \\cern.ch\dfs\Applications\Altium\Datasheets\R0402_Phycomp_RC0402.pdf; Author: CERN DEM JLC; CreateDate: 03.12.2007; LatestRevisionDate: 17.10.2012
R146 R148 = R0402_10K_1%_0.0625W_100PPM: Resistor - 1%; Part Description: General Purpose Thick Film Chip Resistor; Manufacturer: GENERIC; Manufacturer1 Part Number: 232270671003L; TC: ±100ppm/°C; Table: Resistors SMD; Part Number: R0402_10K_1%_0.0625W_100PPM; Component Kind: Standard; Component Type: Standard; Pin Count: 2; Value: 10k; Status: Not recommended; Power: 0.0625W; Tolerance: ±1%; Manufacturer Part Number: R0402_10K_1%_0.0625W_100PPM; Case: 0402; Mounted: Yes; Socket: No; SMD: Yes; Manufacturer1 Example: YAGEO PHYCOMP; Manufacturer1 ComponentHeight: 0.4mm; HelpURL: \\cern.ch\dfs\Applications\Altium\Datasheets\R0402_Phycomp_RC0402.pdf; Author: CERN DEM JLC; CreateDate: 2007-12-03; LatestRevisionDate: 2012-10-17
R172 R174 = R0603_NO-VALUE: Resistor; Part Description: Reserved Footprint For a 0603 (1608) Chip Resistor; PressFit: No; Mounted: No; Part Number: R0603_NO-VALUE; Component Kind: Standard; Component Type: Standard; Pin Count: 2; Value: Undefined; Status: None; Manufacturer: Undefined; Manufacturer Part Number: R0603_NO-VALUE; Case: 0603; Sense: No; Socket: No; SMD: Yes; Manufacturer1 Example: Undefined; Manufacturer1 Part Number: Undefined; Manufacturer1 ComponentHeight: Undefined; HelpURL: Undefined; Author: CERN DEM JLC; CreateDate: 03.12.2007; LatestRevisionDate: 13.03.2008
R232 R233 = R0603_0R_JUMPER: Resistor; Part Description: 1A (0.05R Max DC Resistance) Zero Ohm Jumper; Manufacturer: GENERIC; Manufacturer1 Part Number: NRC06Z0; PressFit: No; Part Number: R0603_0R_JUMPER; Component Kind: Standard; Component Type: Standard; Pin Count: 2; Value: 0; Status: Preferred; Manufacturer Part Number: R0603_0R_JUMPER; Case: 0603; Mounted: Yes; Sense: No; Socket: No; SMD: Yes; Manufacturer1 Example: NIC COMPONENT; Manufacturer1 ComponentHeight: 0.55mm; HelpURL: \\cern.ch\dfs\Applications\Altium\Datasheets\R0603_NIC_NRC.pdf; Author: CERN DEM JLC; CreateDate: 03.12.2007; LatestRevisionDate: 13.03.2008
T1 = BSS138LT1G: N-CHANNEL MOSFET WITH DIODE; Part Description: 50V 200mA N-Channel Enhancement Mode Field-Effect Transistor; Manufacturer: ON SEMICONDUCTOR; PressFit: No; Bonding: No; Part Number: BSS138LT1G; Component Kind: Standard; Component Type: Standard; Device: BSS138LT1G; PackageDescription: SOT23 3-Leads, Pitch 0.95mm - Body 1.4x3mm, IPC Medium Density; Manufacturer Part Number: BSS138LT1G; Pin Count: 3; Case: SOT23-3; Mounted: Yes; Socket: No; SMD: Yes; Sense: No; ComponentHeight: 1.11mm; HelpURL: \\cern.ch\dfs\Applications\Altium\Datasheets\BSS138LT1G.pdf; Author: CERN DEM JLC; CreateDate: 23/03/2009; LatestRevisionDate: 23/03/2009